# Altium project STB_DUTcarrier.PrjPcb
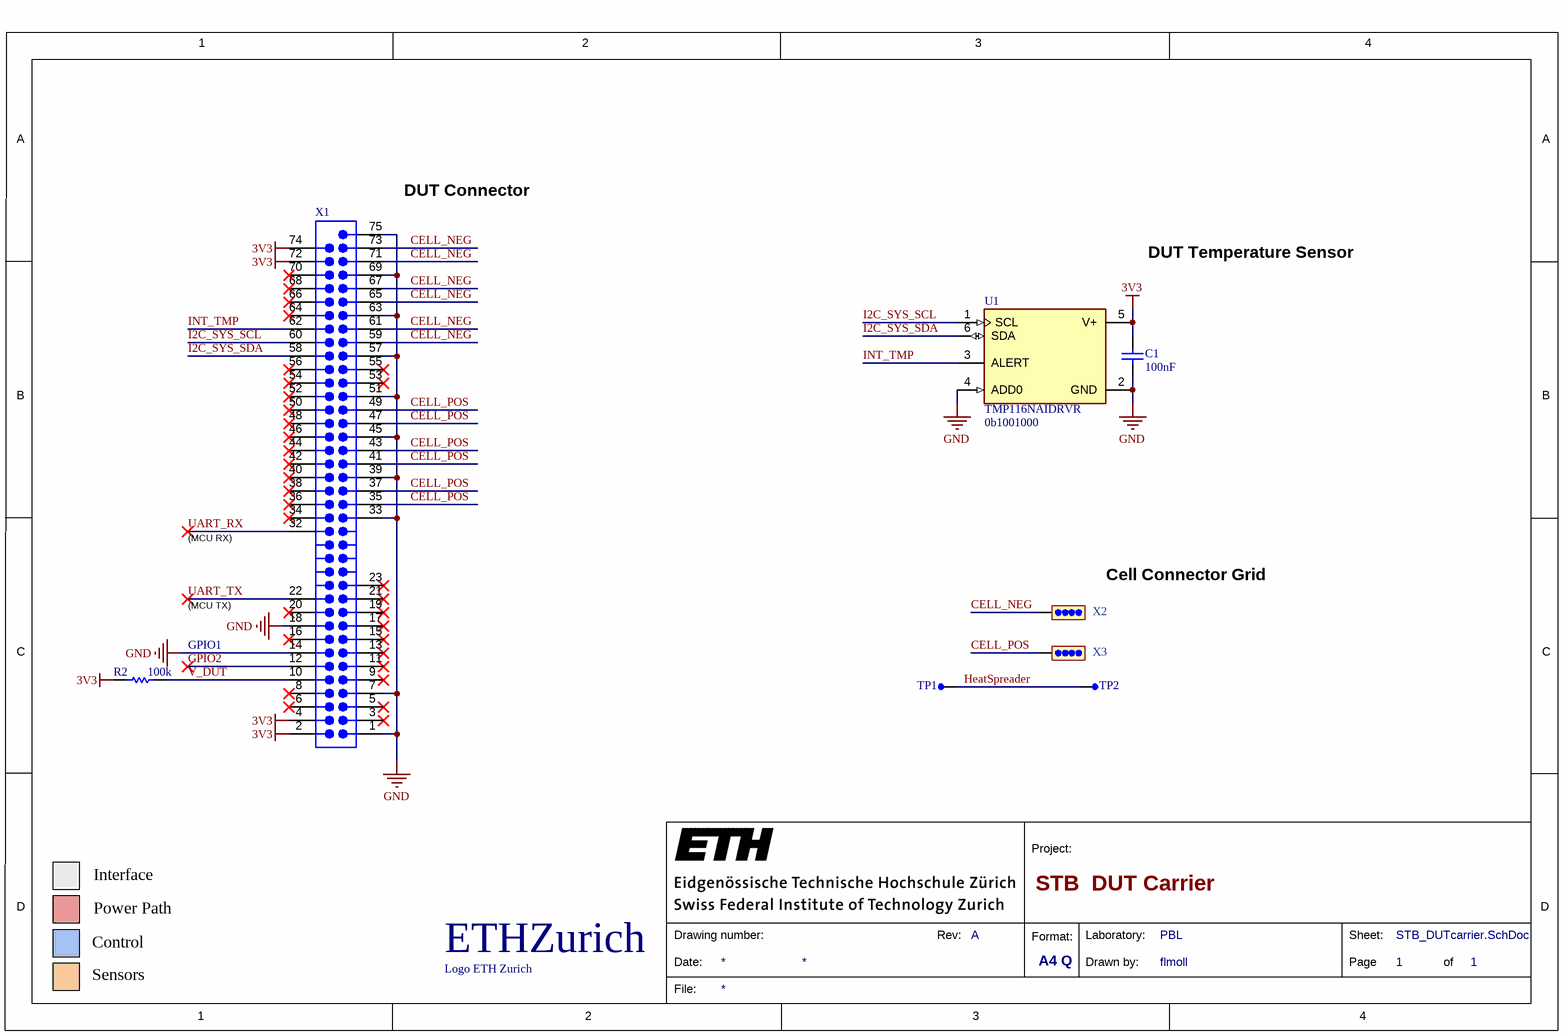
[diagram p0: STB_DUTcarrier.SchDoc]
1 sheet, 9 parts. Net scope: global (net labels, ports and power ports of the same name join across sheets).
Board file: STB_DUTcarrier.PcbDoc

## Sheet STB_DUTcarrier.SchDoc: STB  DUT Carrier
size A4; Author: flmoll; DrawnBy: flmoll; Organization: PBL; Revision: A; SheetNumber: 1; SheetTotal: 1

### Parts
A1  Logo ETH Zurich  [eth-zurich_5mm]  (no BOM)
C1  100nF  [CAPC1050X55X23LL05T13]
R2  100k  [RESC1005X40X25LL05T10]
TP1  testPoint_1mm  [TP-SM-C-100]  (value not drawn)  (no BOM)
TP2  testPoint_1mm  [TP-SM-C-100]  (value not drawn)  (no BOM)
U1  TMP116NAIDRVR  Address: 0b1001000  [FP-DRV0006B-MFG]
X1  CONN PWR CARD EDGE PCB SLOT MALE  [CON-67_0.5MM_PCB_SLOT]  (value not drawn)  (no BOM)
X2  CellConnector  [cellConnector]  (value not drawn)  (no BOM)
X3  CellConnector  [cellConnector]  (value not drawn)  (no BOM)

### Nets
3V3: C1.2 R2.2 U1.5(V+) X1.2 X1.4 X1.72 X1.74
GND: C1.1 U1.2(GND) U1.4(ADD0) X1.1 X1.7 X1.14 X1.18 X1.33 X1.39 X1.45 X1.51 X1.57 X1.63 X1.69 X1.75
CELL_NEG: X1.59 X1.61 X1.65 X1.67 X1.71 X1.73 X2.1
CELL_POS: X1.35 X1.37 X1.41 X1.43 X1.47 X1.49 X3.1
GPIO2: X1.12
HeatSpreader: TP1.1(TP) TP2.1(TP)
I2C_SYS_SCL: U1.1(SCL) X1.60
I2C_SYS_SDA: U1.6(SDA) X1.58
INT_TMP: U1.3(ALERT) X1.62
UART_RX: X1.32
UART_TX: X1.22
V_DUT: R2.1 X1.10

Not connected (* = marked no-connect by the designer): X1 3* 5* 6* 8* 9* 11* 13* 15* 16* 17* 19* 20* 21* 23* 34* 36* 38* 40* 42* 44* 46* 48* 50* 52(51)* 53* 54(52)* 55* 56(53)* 64* 66* 68* 70*

### Notes on the sheet
- (near X1) DUT Connector
- DUT Temperature Sensor
- (MCU RX)
- (near X2) Cell Connector Grid
- (near R2) GPIO1
- (MCU TX)
- Interface
- Power Path
- Control
- Sensors
- 1
- 2
- 3
- 4
- A
- B
- C
- Project:
- D
- Date:
- Drawing number:
- Rev:
- Format:
- A4 Q
- Drawn by:
- Laboratory:
- Page
- Sheet:
- of
- File:
- (in symbol CMP-00038-1) ETHZurich

### Library data of the parts
A1 = CMP-00038-1
C1 = CMP-2000-05439-1: Chip Capacitor, 100 nF, +/- 10%, 16 V, -55 to 125 degC, 0402 (1005 Metric), RoHS, Tape and Reel; Manufacturer: Samsung Electro-Mechanics; Manufacturer Part Number: CL05B104KO5NNNC; Dielectric: X7R; Rated Voltage: 16V; Dielectric Material: Ceramic; Multilayer: Yes; Case Size/Dimension: 0402; Tolerance (%): ±10%; Value: 100nF; Manufacturer URL: http://www.samsungsem.com/global/index.jsp; Datasheet URL: https://datasheet.ciiva.com/29198/458718-da-01-en-vs-kondensator-0402-29198423.pdf; Datasheet Version: Nov-10; Supplier 1: Digi-Key; Supplier Part Number 1: 1276-1001-6-ND; RoHS: Yes; Category: Ceramic Capacitors; Stock 1: 24854634; Pricing 1: 1=0.10000, 10=0.02400, 50=0.01300, 100=0.01050, 500=0.00752, 1000=0.00592, 2500=0.00538, 5000=0.00495 (USD); Mount: Surface Mount; Number of Pins: 2; Package Shape: Rectangular; Size Code: 0402; Terminal Finish: Nickel; Min Operating Temperature: -55°C; Max Operating Temperature: 125°C; JESD-609 Code: e3; Capacitor Type: Ceramic; Negative Tolerance: 10%; Packaging: Tape and Reel; Positive Tolerance: 10%; Rated DC Voltage (URdc): 16V; Temperature Characteristics Code: X7R; Termination: Wraparound; Package Style: SMTMeter; Length: 1mm; Width: 0.5mm; Height: 0.55mm; REACH SVHC: Yes; RoHS Compliant: Yes; ComponentLink1URL: https://datasheet.ciiva.com:443/pdfs/VipMasterIC/IC/SEMS/SEMS-S-A0008384515/SEMS-S-A0008872921-1.pdf?src-supplier=IHS+Markit; ComponentLink1Description: https://datasheet.ciiva.com:443/pdfs/VipMasterIC/IC/SEMS/SEMS-S-A0008384515/SEMS-S-A0008872921-1.pdf?src-supplier=IHS+Markit; ComponentLink2URL: https://datasheet.ciiva.com/26920/getdatasheetpartid-359683-26920169.pdf?src-supplier=Verical; ComponentLink2Description: https://datasheet.ciiva.com/26920/getdatasheetpartid-359683-26920169.pdf?src-supplier=Verical; ComponentLink3URL: https://datasheet.ciiva.com/29198/458718-da-01-en-vs-kondensator-0402-29198423.pdf?src-supplier=Conrad; ComponentLink3Description: https://datasheet.ciiva.com/29198/458718-da-01-en-vs-kondensator-0402-29198423.pdf?src-supplier=Conrad; ComponentLink4URL: https://datasheet.ciiva.com/26309/mlcc-catalogdownload2013-eng-26309003.pdf?src-supplier=Distrelec; ComponentLink4Description: https://datasheet.ciiva.com/26309/mlcc-catalogdownload2013-eng-26309003.pdf?src-supplier=Distrelec; ComponentLink5URL: https://datasheet.ciiva.com/16208/cl05b104kq5nnnc-16208343.pdf?src-supplier=Future+Electronics; ComponentLink5Description: https://datasheet.ciiva.com/16208/cl05b104kq5nnnc-16208343.pdf?src-supplier=Future+Electronics
R2 = CMP-2002-07343-1: Part Number: RC0402FR-07100KL; Manufacturer: Yageo / Phycomp; Tolerance: 1%; Rated Power Dissipation (P): 62.5mW; Rated Temperature: 70°C; Value: 100 kOhm; Temperature Coefficient: 100ppm/°C; Working Voltage: 50V; Additional Feature: LASER TRIMMABLE; Package Height: 0.35mm; Package Length: 1mm; Package Width: 0.5mm; Supplier 1: Digi-Key; Supplier Part Number 1: 311-100KLRDKR-ND; Manufacturer Part Number: RC0402FR-07100KL; RoHS: Yes; Category: Chip SMD Resistors; Stock 1: 43269933; Pricing 1: 1=0.10000, 10=0.01500, 100=0.00600, 1000=0.00267, 2500=0.00232, 5000=0.00192 (USD); Mount: Surface Mount; Number of Pins: 2; Size Code: 0402; Terminal Finish: Nickel; Package Shape: Rectangular; Min Operating Temperature: -55°C; Max Operating Temperature: 155°C; Resistor Type: FIXED RESISTOR; Technology: METAL GLAZE/THICK FILM; Termination: Wraparound; JESD-609 Code: e3; Construction: Chip; Package Style: SMTMeter; Packaging: Tape and Reel; REACH SVHC: Yes; RoHS Compliant: Yes; ComponentLink1URL: https://datasheet.ciiva.com:443/pdfs/VipMasterIC/IC/YAGO/YAGO-S-A0008145938/YAGO-S-A0008145938-1.pdf?src-supplier=IHS+Markit; ComponentLink1Description: https://datasheet.ciiva.com:443/pdfs/VipMasterIC/IC/YAGO/YAGO-S-A0008145938/YAGO-S-A0008145938-1.pdf?src-supplier=IHS+Markit
TP1 TP2 = testPoint_1mm: testPoint 1mm
U1 = CMP-04948-000013-1: SENSOR DIGITAL -55C-125C 6WSON; Manufacturer: Texas Instruments; Sensor Output: I2C,SMBus; Max Junction Temp: +150°C; Standoff Height: 0mm; Min Supply Voltage: 1.9V; Max Supply Voltage: 5.5V; Resolution: 16bits; Operating Supply Current: 3.5-135uA; Package Shape/Style: Square; Accuracy-Max (Cel): 0.5°C; Number of Bits: 16; Output Interface Type: 2-Wire; Sensors/Transducers Type: TEMPERATURE SENSOR,SWITCH/DIGITAL OUTPUT,SERIAL; Body Breadth: 2inch; Body Height: 0.8mm; Body Length or Diameter: 2mm; Manufacturer Part Number: TMP116NAIDRVR; Temperature Range Low: -55°C; Temperature: -55°C to +125°C; Ipc Land Pattern Name: DFN200X200X80-6; Device Class L1: Sensors; Package: DRV0006B; Interface: I2C,SMBus; Device Class L3: unset; Ambient Temperature Range Low: -55°C; Lead Free: Yes; Height: 0.8mm; Temperature Range High: +125°C; Digikey Description: SENSOR DIGITAL -55C-125C 6WSON; RoHS: TRUE; Mouser Description: ±0.2°C Accurate Digital Temperature Sensor With NV Memory 6-WSON -55 to 125; Ambient Temperature Range High: +150°C; ComponentLink2Description: Datasheet; Category: IC; Device Class L2: Temperature and Humidity Sensors; ComponentLink2URL: https://www.ti.com/lit/ds/symlink/tmp116.pdf; Octopart: https://octopart.com/tmp116naidrvr-texas+instruments-82367758; Automotive: No; Supplier 1: Digi-Key; Supplier Part Number 1: 296-48306-6-ND; Stock 1: 6627; Pricing 1: 1=2.48000, 10=2.22500, 25=2.09880, 100=1.78820, 250=1.67904, 500=1.46916, 1000=1.26720 (USD); Mount: Surface Mount; Housing Material: Plastic; Terminal Finish: Nickel; Min Operating Temperature: -55°C; Max Operating Temperature: 150°C; JESD-609 Code: e4; Termination: Solder; REACH SVHC: Yes; RoHS Compliant: Yes; ComponentLink1URL: https://www.ti.com:443/lit/ds/symlink/tmp116.pdf?src-supplier=IHS+Markit; ComponentLink1Description: https://www.ti.com:443/lit/ds/symlink/tmp116.pdf?src-supplier=IHS+Markit; ComponentLink3URL: http://www.ti.com/lit/ds/symlink/tmp116.pdf?src-supplier=Digi-Key; ComponentLink3Description: http://www.ti.com/lit/ds/symlink/tmp116.pdf?src-supplier=Digi-Key
X1 = CMP-01224-1: Mates with 2199119-4 - No BOM; Number of Positions: 67; Pitch: 0.5mm; Card Thickness: 0.8mm; Card Type: Non Specified - Dual Edge; Gender: Male; Mates with: 2199119-4
X2 X3 = CellConnector: SMD dummy for cell connection